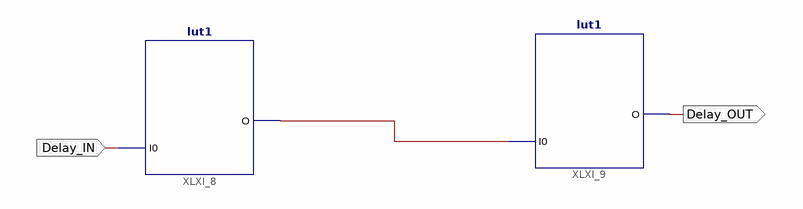
[diagram p0: schematic sheet 1]
// Xilinx ISE schematic AnalogDelayLine.sch (virtex4) as structural Verilog: 2 symbols, 2 ports
module AnalogDelayLine (
  input  Delay_IN,
  output Delay_OUT
);

  wire XLXN_7;

  lut1 #(.INIT("2"), .LOC("SLICE_X0Y0"), .KEEP("true")) XLXI_8 (.I0(Delay_IN), .O(XLXN_7));
  lut1 #(.INIT("2"), .LOC("SLICE_X0Y255"), .KEEP("true")) XLXI_9 (.I0(XLXN_7), .O(Delay_OUT));

  // Notes on the sheet:
  //   KEEP on signal XLXN_7 = TRUE
endmodule
